# EAGLE schematic 7seg (EAGLE 6.5.0)
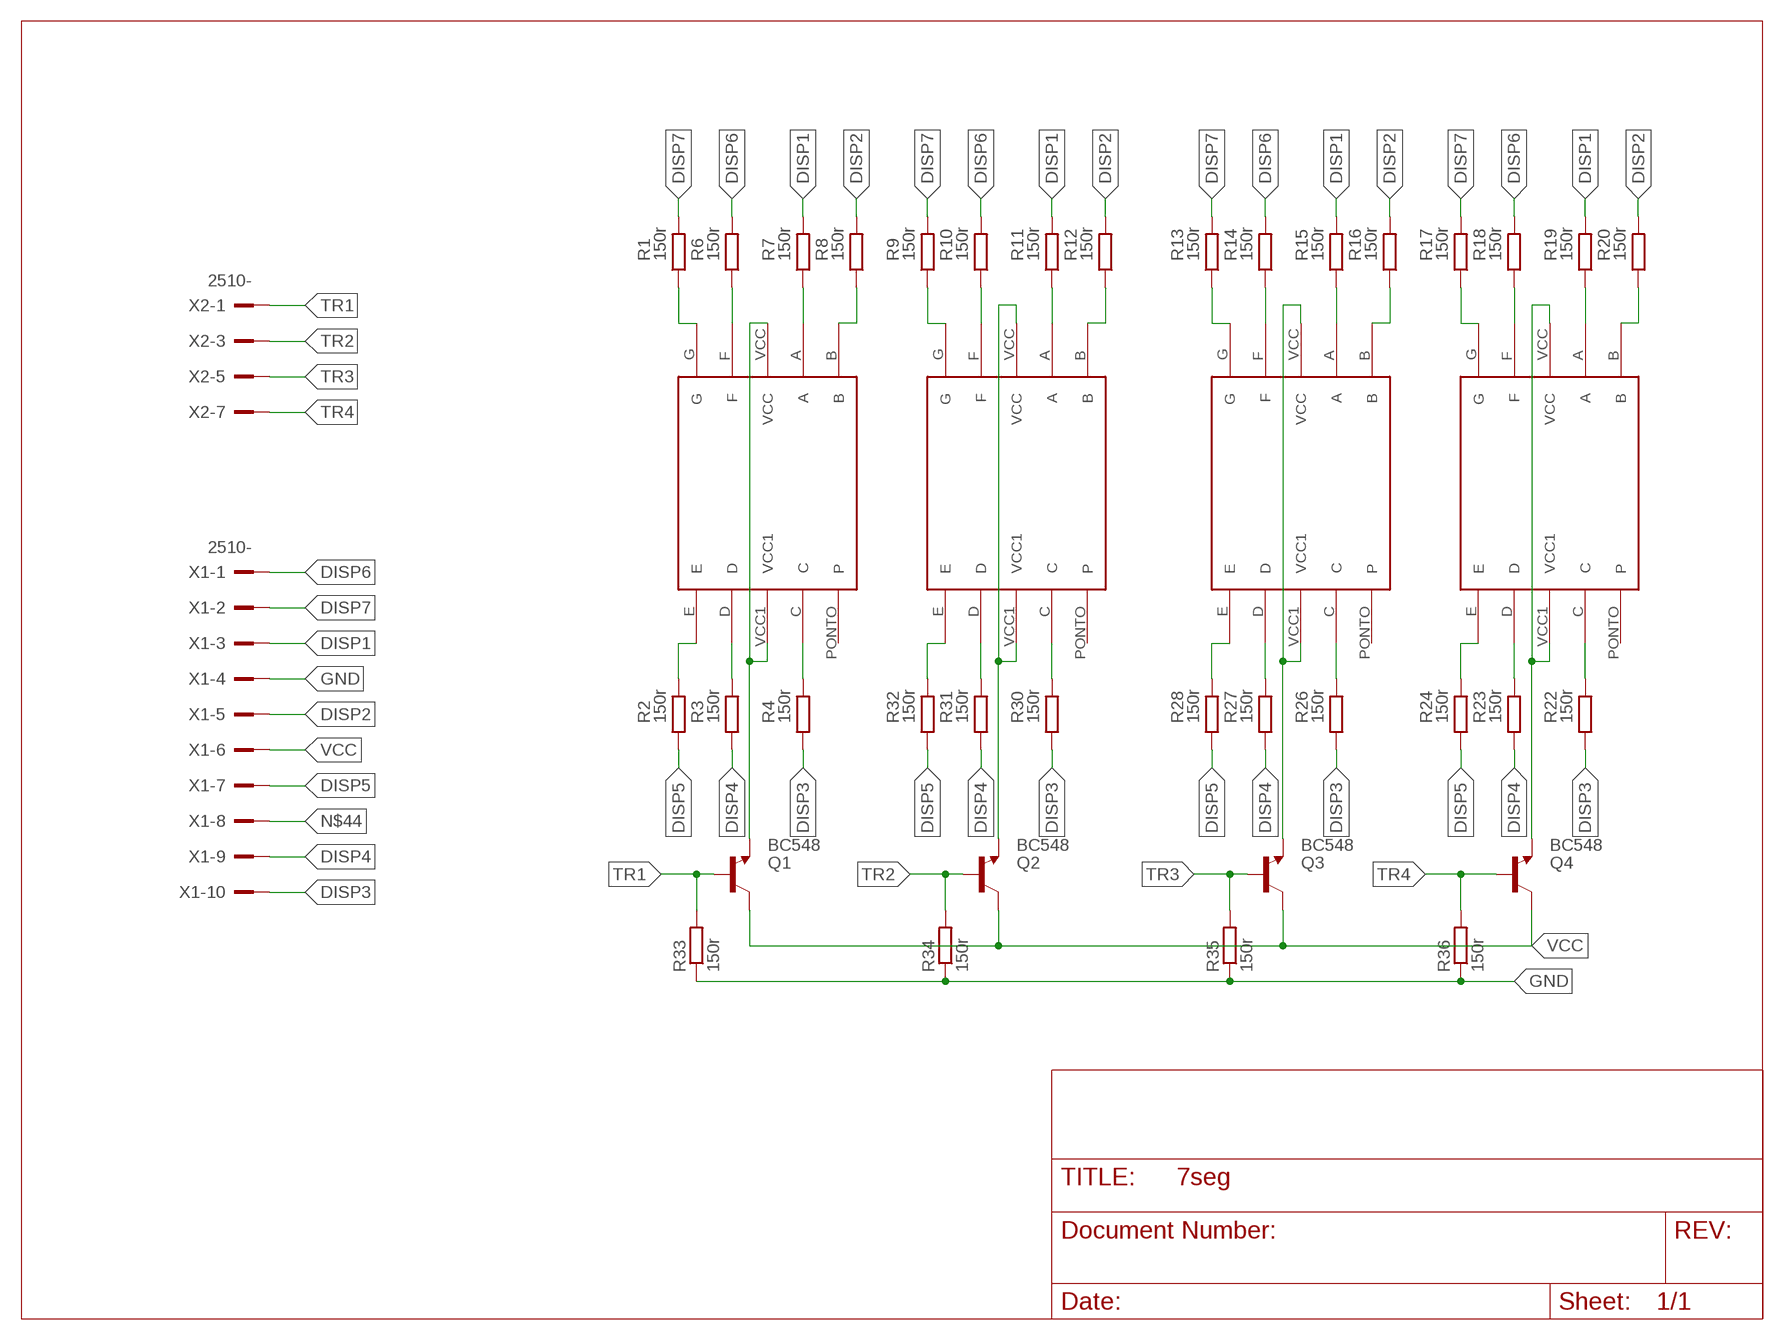
[diagram p0: schematic, sheet 1]

## Parts
Q1  BC548  [TO92-EBC]
Q2  BC548  [TO92-EBC]
Q3  BC548  [TO92-EBC]
Q4  BC548  [TO92-EBC]
R1  150r  R-EU_  [0204/ELVYS]
R2  150r  R-EU_  [0204/ELVYS]
R3  150r  R-EU_  [0204/ELVYS]
R4  150r  R-EU_  [0204/ELVYS]
R6  150r  R-EU_  [0204/ELVYS]
R7  150r  R-EU_  [0204/ELVYS]
R8  150r  R-EU_  [0204/ELVYS]
R9  150r  R-EU_  [0204/ELVYS]
R10  150r  R-EU_  [0204/ELVYS]
R11  150r  R-EU_  [0204/ELVYS]
R12  150r  R-EU_  [0204/ELVYS]
R13  150r  R-EU_  [0204/ELVYS]
R14  150r  R-EU_  [0204/ELVYS]
R15  150r  R-EU_  [0204/ELVYS]
R16  150r  R-EU_  [0204/ELVYS]
R17  150r  R-EU_  [0204/ELVYS]
R18  150r  R-EU_  [0204/ELVYS]
R19  150r  R-EU_  [0204/ELVYS]
R20  150r  R-EU_  [0204/ELVYS]
R22  150r  R-EU_  [0204/ELVYS]
R23  150r  R-EU_  [0204/ELVYS]
R24  150r  R-EU_  [0204/ELVYS]
R26  150r  R-EU_  [0204/ELVYS]
R27  150r  R-EU_  [0204/ELVYS]
R28  150r  R-EU_  [0204/ELVYS]
R30  150r  R-EU_  [0204/ELVYS]
R31  150r  R-EU_  [0204/ELVYS]
R32  150r  R-EU_  [0204/ELVYS]
R33  150r  R-EU_  [0204/ELVYS]
R34  150r  R-EU_  [0204/ELVYS]
R35  150r  R-EU_  [0204/ELVYS]
R36  150r  R-EU_  [0204/ELVYS]
U$1  HS-12101BS  [HS-12101BS]
U$2  HS-12101BS  [HS-12101BS]
U$3  HS-12101BS  [HS-12101BS]
U$4  HS-12101BS  [HS-12101BS]
X1  2510-  [PAK100/2500-10]
X2  2510-  [PAK100/2500-10]

## Nets
DISP1: R7.P$2 R11.P$2 R15.P$2 R19.P$2 X1.3
DISP2: R8.P$2 R12.P$2 R16.P$2 R20.P$2 X1.5
DISP3: R4.P$1 R22.P$1 R26.P$1 R30.P$1 X1.10
DISP4: R3.P$1 R23.P$1 R27.P$1 R31.P$1 X1.9
DISP5: R2.P$1 R24.P$1 R28.P$1 R32.P$1 X1.7
DISP6: R6.P$2 R10.P$2 R14.P$2 R18.P$2 X1.1
DISP7: R1.P$2 R9.P$2 R13.P$2 R17.P$2 X1.2
GND: R33.P$1 R34.P$1 R35.P$1 R36.P$1 X1.4
N$1: Q1.E U$1.VCC U$1.VCC1
N$2: Q2.E U$2.VCC U$2.VCC1
N$3: R1.P$1 U$1.G
N$4: R2.P$2 U$1.E
N$5: R4.P$2 U$1.C
N$7: R3.P$2 U$1.D
N$8: R6.P$1 U$1.F
N$9: R7.P$1 U$1.A
N$10: R8.P$1 U$1.B
N$11: R9.P$1 U$2.G
N$12: R10.P$1 U$2.F
N$13: R11.P$1 U$2.A
N$14: R12.P$1 U$2.B
N$15: R13.P$1 U$3.G
N$16: R14.P$1 U$3.F
N$17: R15.P$1 U$3.A
N$18: R16.P$1 U$3.B
N$19: R17.P$1 U$4.G
N$20: R18.P$1 U$4.F
N$21: R19.P$1 U$4.A
N$22: R20.P$1 U$4.B
N$24: R22.P$2 U$4.C
N$25: R23.P$2 U$4.D
N$26: R24.P$2 U$4.E
N$28: R26.P$2 U$3.C
N$29: R27.P$2 U$3.D
N$30: R28.P$2 U$3.E
N$32: R30.P$2 U$2.C
N$33: R31.P$2 U$2.D
N$34: R32.P$2 U$2.E
N$36: Q4.E U$4.VCC U$4.VCC1
N$44: X1.8
N$48: Q3.E U$3.VCC U$3.VCC1
TR1: Q1.B R33.P$2 X2.1
TR2: Q2.B R34.P$2 X2.3
TR3: Q3.B R35.P$2 X2.5
TR4: Q4.B R36.P$2 X2.7
VCC: Q1.C Q2.C Q3.C Q4.C X1.6
Unconnected: U$1.PONTO(P) U$2.PONTO(P) U$3.PONTO(P) U$4.PONTO(P) X2.2 X2.4 X2.6 X2.8 X2.9 X2.10

## Library data of the parts
Q1-Q4 = transistor-npn:BC548*: NPN Transistor
R1-R4 R6-R20 R22-R24 R26-R28 R30-R36 = rcl:R-EU_: RESISTOR, European symbol
U$1-U$4 = display-hp:HS-12101BS
X1 X2 = con-3m:2510-: 3M (TM) Pak 100 4-Wall Header Source: 3M; MF: 3M; MPN: 2510-6002UB; OC_FARNELL: 9838244; OC_NEWARK: 46F4725